# Altium schematic sheet Power.SchDoc: Power
size A3; Organization: Use Organization_Name in ProjParam; Address1: Eliot Ferragni; Address2: STI-MOBOTS; Address3: EPFL; Address4: CH-1015 LAUSANNE; DocumentNumber: 4; Revision: A; SheetNumber: 4; SheetTotal: 11; ApprovedBy: Init ApprovedBy in DocParam; CheckedBy: Init CheckedBy in DocParam; Author: Init Author in DocParam; CompanyName: Init CompanyName in DocParam; DrawnBy: Init DrawBy in DocParam; Engineer: Init Engineer in DocParam; Title2: Power button + 3V + 1.2V + alimentation measures; DocumentName: Init DocumentName in DocParam; ProjectName: Init ProjectName in DocParam
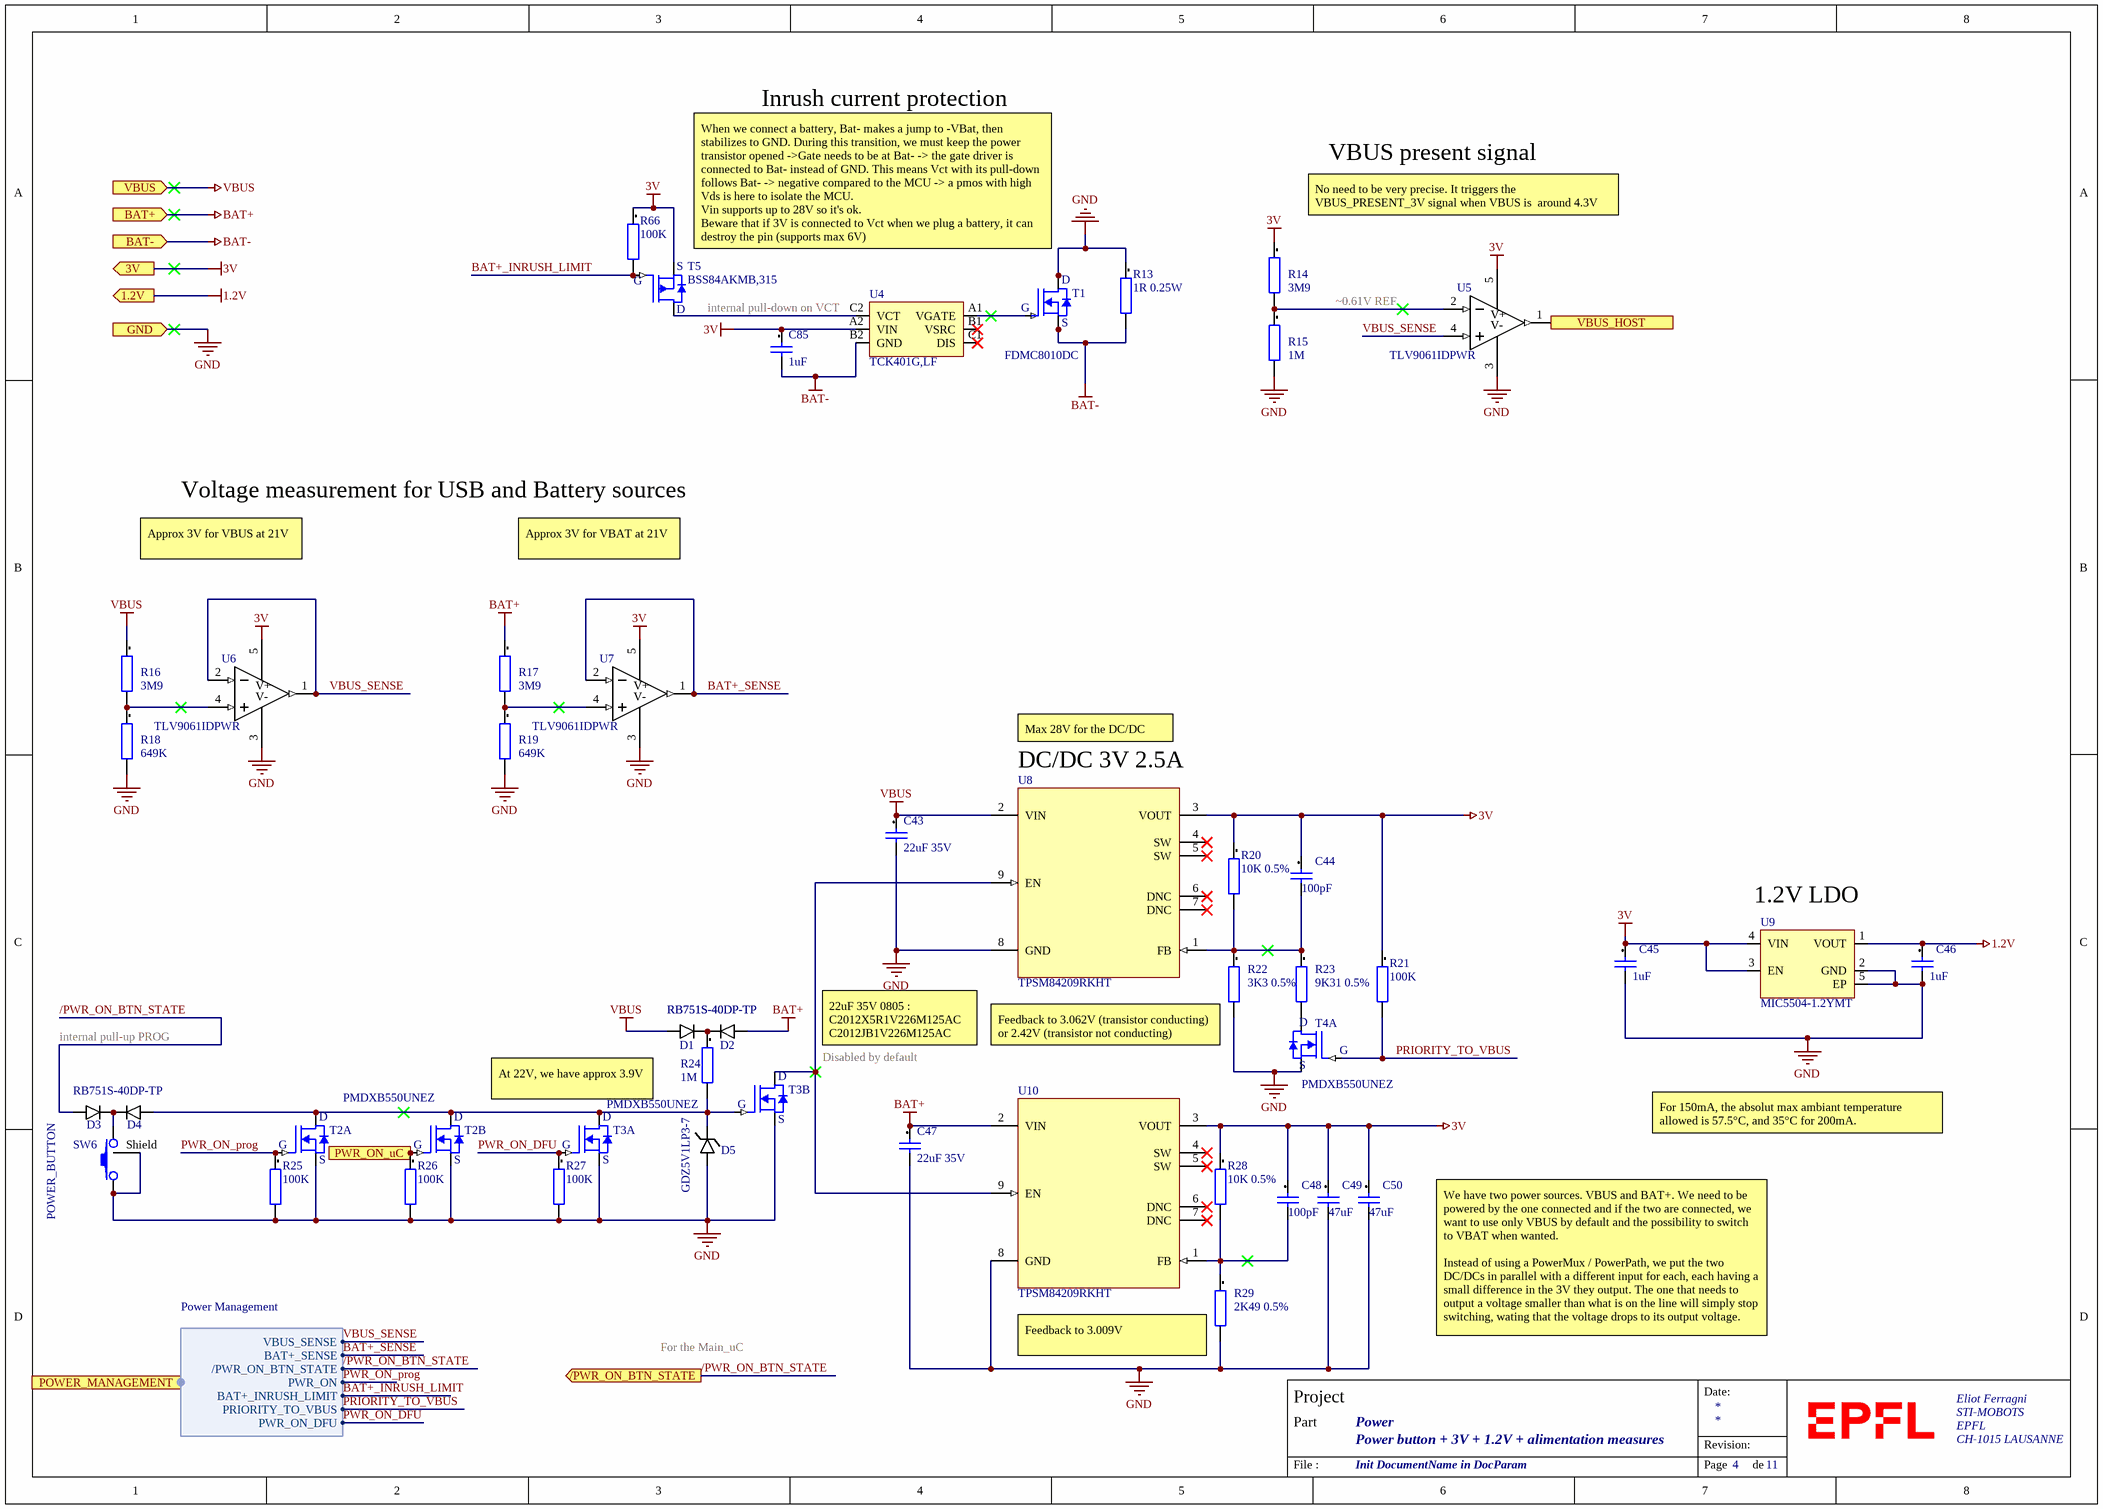
[diagram p0: Power.SchDoc]

## Parts
C43  22uF 35V  [CAPC2012X13L]
C44  100pF  [CAPC0201(0603)33_L]
C45  1uF  [CAPC0201(0603)33_L]
C46  1uF  [CAPC0201(0603)33_L]
C47  22uF 35V  [CAPC2012X13L]
C48  100pF  [CAPC0201(0603)33_L]
C49  47uF  [CAPC1608X08L]
C50  47uF  [CAPC1608X08L]
C85  1uF  [CAPC0201(0603)33_L]
D1  RB751S-40DP-TP  [0201 diode]
D2  RB751S-40DP-TP  [0201 diode]
D3  RB751S-40DP-TP  [0201 diode]  (value not drawn)
D4  RB751S-40DP-TP  [0201 diode]
D5  GDZ5V1LP3-7  [X3-DFN0603-2]
R13  1R 0.25W  [RESC1608X06L]
R14  3M9  [RESC0201(0603)_L]
R15  1M  [RESC0201(0603)_L]
R16  3M9  [RESC0201(0603)_L]
R17  3M9  [RESC0201(0603)_L]
R18  649K  [RESC0201(0603)_L]
R19  649K  [RESC0201(0603)_L]
R20  10K 0.5%  [RESC0201(0603)_L]
R21  100K  [RESC0201(0603)_L]
R22  3K3 0.5%  [RESC1005X04L]
R23  9K31 0.5%  [RESC1005X04L]
R24  1M  [RESC0201(0603)_L]
R25  100K  [RESC0201(0603)_L]
R26  100K  [RESC0201(0603)_L]
R27  100K  [RESC0201(0603)_L]
R28  10K 0.5%  [RESC0201(0603)_L]
R29  2K49 0.5%  [RESC1005X04L]
R66  100K  [RESC0201(0603)_L]
SW6  button  [C&K_KMR2]  (value not drawn)
T1  FDMC8010DC  [PQFN8 3.3X3.3]
T2  PMDXB550UNEZ  [DFN1010B-6]  (parts A,B of 2)
T3  PMDXB550UNEZ  [DFN1010B-6]  (parts A,B of 2)
T4  PMDXB550UNEZ  [DFN1010B-6]  (part A of 2)
T5  BSS84AKMB,315  [DFND1006B-3]
U4  TCK401G,LF  [WCSP6E]
U5  TLV9061IDPWR  [X2SON-5]
U6  TLV9061IDPWR  [X2SON-5]
U7  TLV9061IDPWR  [X2SON-5]
U8  TPSM84209RKHT  [QFN-FCMOD (RKH) 9]
U9  Manufacturer Part Number: MIC5504-1.2YMT  [TDFN-4]  (hidden comment: MIC5504-1.2YMT-TR)
U10  TPSM84209RKHT  [QFN-FCMOD (RKH) 9]

## Ports
1.2V (out), 3V (out), /PWR_ON_BTN_STATE (out), BAT+ (in), BAT- (in), GND (in), POWER_MANAGEMENT (harness Power Management), PWR_ON_uC (in), VBUS (in), VBUS_HOST (out)

## Harnesses
Power Management: VBUS_SENSE, BAT+_SENSE, /PWR_ON_BTN_STATE, PWR_ON, BAT+_INRUSH_LIMIT, PRIORITY_TO_VBUS, PWR_ON_DFU

## Nets
1.2V: C46.1 U9.1(VOUT) ; port 1.2V
3V: C44.1 C45.1 C48.1 C49.1 C50.1 C85.1 R14.1 R20.1 R21.1 R28.1 R66.1 T5.2(S) U4.A2(VIN) U5.5(VCC) U6.5(VCC) U7.5(VCC) U8.3(VOUT) U9.3(EN) U9.4(VIN) U10.3(VOUT) ; port 3V
BAT+: C47.1 D2.1(C) R17.1 U10.2(VIN) ; port BAT+
BAT-: C85.2 R13.2 T1.1(S) T1.2(S) T1.3(S) U4.B2(GND) ; port BAT-
GND: C43.2 C45.2 C46.2 C47.2 C49.2 C50.2 D5.2(C) R13.1 R15.2 R18.2 R19.2 R22.2 R25.2 R26.2 R27.2 R29.2 SW6.1 SW6.Shield T1.5(D) T1.6(D) T1.7(D) T1.8(D) T1.9(D) T2.1(S) T2.4(S) T3.1(S) T3.4(S) T4.1(S) U5.3(VEE) U6.3(VEE) U7.3(VEE) U8.8(GND) U9.2(GND) U9.5(EP) U10.8(GND) ; port GND
VBUS: C43.1 D1.1(C) R16.1 U8.2(VIN) ; port VBUS
/PWR_ON_BTN_STATE: D3.1(C) ; port /PWR_ON_BTN_STATE, port POWER_MANAGEMENT./PWR_ON_BTN_STATE
BAT+_INRUSH_LIMIT: R66.2 T5.1(G) ; port POWER_MANAGEMENT.BAT+_INRUSH_LIMIT
BAT+_SENSE: U7.1(OUT) U7.2(IN-) ; port POWER_MANAGEMENT.BAT+_SENSE
PRIORITY_TO_VBUS: R21.2 T4.2(G) ; port POWER_MANAGEMENT.PRIORITY_TO_VBUS
PWR_ON_DFU: R27.1 T3.2(G) ; port POWER_MANAGEMENT.PWR_ON_DFU
PWR_ON_prog: R25.1 T2.2(G) ; port POWER_MANAGEMENT.PWR_ON
PWR_ON_uC: R26.1 T2.5(G) ; port PWR_ON_uC
VBUS_HOST: U5.1(OUT) ; port VBUS_HOST
VBUS_SENSE: U5.4(IN+) U6.1(OUT) U6.2(IN-) ; port POWER_MANAGEMENT.VBUS_SENSE
NetC44_2: C44.2 R20.2 R22.1 R23.1 U8.1(FB)
NetC48_2: C48.2 R28.2 R29.1 U10.1(FB)
NetD1_2: D1.2(C) D2.2(C) R24.1
NetD3_2: D3.2(C) D4.2(C) SW6.2
NetD4_1: D4.1(C) D5.1(C) R24.2 T2.3(D) T2.6(D) T3.5(G) T3.6(D)
NetR14_2: R14.2 R15.1 U5.2(IN-)
NetR16_2: R16.2 R18.1 U6.4(IN+)
NetR17_2: R17.2 R19.1 U7.4(IN+)
NetR23_2: R23.2 T4.6(D)
NetT1_4: T1.4(G) U4.A1(VGATE)
NetT3_3: T3.3(D) U8.9(EN) U10.9(EN)
NetT5_3: T5.3(D) U4.C2(VCT)

Not connected (* = marked no-connect by the designer): U4 B1(VSRC)* C1(DIS)*; U8 4(SW)* 5(SW)* 6(DNC)* 7(DNC)*; U10 4(SW)* 5(SW)* 6(DNC)* 7(DNC)*

## Notes on the sheet
- Inrush current protection
- VBUS present signal
- When we connect a battery, Bat- makes a jump to -VBat, then stabilizes to GND. During this transition, we must keep the power transistor opened ->Gate needs to be at Bat- -> the gate driver is connected to Bat- instead of GND. This means Vct with its pull-down follows Bat- -> negative compared to the MCU -> a pmos with high Vds is here to isolate the MCU.
  Vin supports up to 28V so it's ok.
  Beware that if 3V is connected to Vct when we plug a battery, it can destroy the pin (supports max 6V)
- No need to be very precise. It triggers the VBUS_PRESENT_3V signal when VBUS is  around 4.3V
- (near U4) internal pull-down on VCT
- ~0.61V REF
- Voltage measurement for USB and Battery sources
- Approx 3V for VBUS at 21V
- Approx 3V for VBAT at 21V
- (near U8) DC/DC 3V 2.5A
- Max 28V for the DC/DC
- (near U9) 1.2V LDO
- internal pull-up PROG
- 22uF 35V 0805 :
  C2012X5R1V226M125AC
  C2012JB1V226M125AC
- (near R22) Feedback to 3.062V (transistor conducting) or 2.42V (transistor not conducting)
- At 22V, we have approx 3.9V
- Disabled by default
- For 150mA, the absolut max ambiant temperature allowed is 57.5°C, and 35°C for 200mA.
- POWER_BUTTON
- For the Main_uC
- (near R29) Feedback to 3.009V
- We have two power sources. VBUS and BAT+. We need to be powered by the one connected and if the two are connected, we want to use only VBUS by default and the possibility to switch to VBAT when wanted.
  Instead of using a PowerMux / PowerPath, we put the two DC/DCs in parallel with a different input for each, each having a small difference in the 3V they output. The one that needs to output a voltage smaller than what is on the line will simply stop switching, wating that the voltage drops to its output voltage.
- Date:
- Project
- Part
- Revision:
- File :
- Page
- de
- (in symbol TLV9061IDPWR) V+; V-

## Library data of the parts
C43 C47 = TBD Capacitor[[/\]]0805[[/\]]1: Capacitor 0805; Manufacturer: TDK; Manufacturer part number: C2012X5R1V226M125AC; Preference: 1; Currentie: CHF; Type: SMD; Note: To buy by assembler; Size: 0805; Footprint Acort: 0805_G; ROHS: True; DateLastUpdate: 2012-11-19 / 14:37:26; Package / Case: Capacitor 0805
C44-C46 C48 C85 = TBD Capacitor[[/\]]0201[[/\]]1: Capacitor 0201; Preference: 1; Currentie: CHF; Type: SMD; Note: To buy by assembler; Size: 0201; Footprint Acort: 0201; ROHS: True; DateLastUpdate: 2018-10-19 / 8:59:52 AM; Manufacturer: -; Manufacturer part number: -; Package / Case: Capacitor 0201
C49 C50 = TBD Capacitor[[/\]]0603[[/\]]1: Capacitor 0603; Preference: 1; Currentie: CHF; Type: SMD; Note: To buy by assembler; Size: 0603; Footprint Acort: 0603_G; ROHS: True; DateLastUpdate: 2012-11-19 / 14:36:40; Manufacturer: -; Manufacturer part number: -; Package / Case: Capacitor 0603
D1-D4 = RB751S-40DP-TP: Schottky Diodes & Rectifiers 203 Package Schottky Diodes; Manufacturer: Micro Commercial Co; Reverse Voltage (DC): 28V; Average Rectified Current: 30mA; Element Configuration: Single; Forward Current: 200mA; Max Repetitive Reverse Voltage (Vrrm): 40V; Peak Reverse Current: 500nA; Max Power Dissipation: 100mW; Type: SMD; Note: To buy by assembler; Supplier 1: Digi-Key; Manufacturer Part Number: RB751S-40DP-TP; Stock 1: 104704; Pricing 1: 1=0.3, 10=0.27, 100=0.1514, 500=0.08112, 1000=0.05516 (USD); Mount: Surface Mount; Case/Package: 0201; Case Code (Metric): 0603; Case Code (Imperial): 0201; Max Operating Temperature: 125°C; Packaging: Tape and Reel; Termination: SMD/SMT; Max Forward Surge Current (Ifsm): 200mA; Package Quantity: 10000; Max Reverse Voltage (DC): 40V; Length: 0.67mm; Height: 0.34mm; Width: 0.37mm; Supplier Part Number 1: RB751S-40DP-TPMSCT-ND; Package / Case: Diode 0201
D5 = GDZ5V1LP3-7: DIODE ZENER 5.1V 250MW 2DFN; Manufacturer: Diodes Incorporated; Tolerance: 5%; Max Reverse Leakage Current: 200nA; Element Configuration: Single; Type: SMD; Note: To buy by assembler; Supplier 1: Digi-Key; Manufacturer Part Number: GDZ5V1LP3-7; Stock 1: 50190; Pricing 1: 1=0.37, 10=0.303, 100=0.1607, 500=0.1057, 1000=0.07188 (USD); Mount: Surface Mount; Case/Package: DFN; Number of Pins: 2; Min Operating Temperature: -55°C; Max Operating Temperature: 150°C; Packaging: Tape and Reel; Max Power Dissipation: 250mW; Package Quantity: 10000; Zener Voltage: 5.1V; Zener Current: 200nA; Voltage Tolerance: 5%; Peak Reverse Current: 200nA; Power Rating: 250mW; Length: 0.62mm; Height: 0.3mm; Width: 0.32mm; Radiation Hardening: No; REACH SVHC: No SVHC; ComponentLink1URL: https://www.diodes.com/assets/Datasheets/GDZxVxLP3.pdf; ComponentLink1Description: https://www.diodes.com/assets/Datasheets/GDZxVxLP3.pdf; Supplier Part Number 1: GDZ5V1LP3-7DICT-ND; Package / Case: X3-DFN0603-2
R13 = TBD[[/\]]0603[[/\]]1: Resistor 0603; Preference: 1; Currentie: CHF; Note: To buy by assembler; Size: 0603; Footprint Acort: 0603; ROHS: True; DateLastUpdate: 2012-11-19 / 14:13:33; Type: SMD; Manufacturer: -; Manufacturer part number: -; Package / Case: Resistor 0603
R14-R21 R24-R28 R66 = TBD[[/\]]0201[[/\]]1: Resistor 0201; Preference: 1; Currentie: CHF; Note: To buy by assembler; Size: 0201; Footprint Acort: 0201; ROHS: True; DateLastUpdate: 2018-10-19 / 9:06:49 AM; Type: SMD; Manufacturer: -; Manufacturer part number: -; Package / Case: Resistor 0201
R22 R23 R29 = TBD[[/\]]0402[[/\]]1: Resistor 0402; Preference: 1; Currentie: CHF; Note: To buy by assembler; Size: 0402; Footprint Acort: 0402; ROHS: True; DateLastUpdate: 2012-11-19 / 14:13:38; Type: SMD; Manufacturer: -; Manufacturer part number: -; Package / Case: Resistor 0402
SW6 = C&K KMR2: KMR221GLFS; Manufacturer: C&K; Manufacturer Nr: 7-188275-6; Preference: 1; Currentie: CHF; Quant_1: 10; Quant_2: 900; Circuit: SPST-NO; Switch Function: Off-Mom; Contact Rating @ Voltage: 0.05A @ 32VDC; Actuator Type: Standard; Actuator Height off PCB, from Pins: 1.90mm; Actuator Orientation: Top Actuated; Outline: 4.60mm x 2.80mm; Illumination: Non-Illuminated; Operating Force: 200gf; Switch Travel: 0.25mm; Mechanical Life: 200,000 Cycles; Note: To buy by assembler; Footprint Acort: ToDefine; ComponentLink1Description: Datasheet; ComponentLink1URL: http://ecommas.tycoelectronics.com/commerce/DocumentDelivery/DDEController?Action=showdoc&DocId=Customer+Drawing%7F188275%7FR%7Fpdf%7FEnglish%7FC_188275_R.pdf; Supplier: Farnell; Supplier Nr: 1056234; ComponentLink2Description: Farnell link; ComponentLink2URL: http://fr.farnell.com/jsp/displayProduct.jsp?sku=1056234; ROHS: True; Type: SMD; Orientation: Vertical; DateLastUpdate: 2007-12-04 / 09:15:57; Price_1: 1,1; Price_2: 0,924; Supplier 1: Digi-Key; Manufacturer Part Number: KMR221GLFS; Category: Switches; Stock 1: 20549; Pricing 1: 1=0.51, 10=0.493, 25=0.484, 50=0.4656, 100=0.4017, 250=0.3652, 500=0.34694, 1000=0.2739 (USD); Packaging: Cut Tape (CT); Mounting Type: Surface Mount; Termination Style: Gull Wing; Illumination Voltage (Nominal): -; Illumination Type, Color: -; Ingress Protection: -; Features: Grounding Pin; Actuator Material: -; Operating Temperature: -40°C ~ 85°C; ComponentLink3URL: http://www.ck-components.com/index.php?module=media&action=Display&cmpref=14414&lang=en&width=&height=&format=&alt=; ComponentLink3Description: http://www.ck-components.com/index.php?module=media&action=Display&cmpref=14414&lang=en&width=&height=&format=&alt=; Supplier Part Number 1: 401-1427-1-ND; Package / Case: SMD Button
T1 = FDMC8010DC: Power transistor; Manufacturer: ON Semiconductor / Fairchild; Element Configuration: Dual; Type: SMD; Note: To buy by assembler; Supplier 1: Digi-Key; Manufacturer Part Number: FDMC8010DC; Stock 1: 36; Pricing 1: 1 = 1,29000, 10 = 1,15600, 100 = 0,90120, 500 = 0,74448, 1000 = 0,58774 (USD); RoHS: No; Mount: Surface Mount; Weight: 0.039g; Min Operating Temperature: -55°C; Max Operating Temperature: 150°C; Supplier Part Number 1: FDMC8010DCOSCT-ND; Package / Case: Dual Cool 33
T2-T4 = PMDXB550UNEZ: DUAL N-CHANNEL 30V; Manufacturer: NXP Semiconductors; Continuous Drain Current (ID): 590mA; Max Power Dissipation: 285mW; Rds On Max: 670mR; Input Capacitance: 30.3pF; FET Type: 2 N-Channel; Type: SMD; Note: To buy by assembler; Supplier 1: Digi-Key; Stock 1: 5582; Pricing 1: 1=0.48, 10=0.379, 100=0.2601, 500=0.17838, 1000=0.13379 (USD); Mount: Surface Mount; Min Operating Temperature: -55°C; Max Operating Temperature: 150°C; Drain to Source Voltage (Vdss): 30V; Packaging: Tape and Reel; Supplier Part Number 1: 1727-2277-1-ND; Manufacturer Part Number: PMDXB550UNEZ; Package / Case: DFN1010B-6
T5 = BSS84AKMB,315: MOSFET P-CH 50V 230MA 3DFN; Manufacturer: Nexperia; Supplier 1: Digi-Key; Manufacturer Part Number: BSS84AKMB,315; Stock 1: 17379; Pricing 1: 1 = 0,29000, 10 = 0,23700, 25 = 0,19800, 100 = 0,09680, 500 = 0,08074, 1000 = 0,05610, 2500 = 0,05214, 5000 = 0,04510 (USD); RoHS: No; ComponentLink1URL: https://assets.nexperia.com/documents/data-sheet/BSS84AKMB.pdf?src-supplier=Digi-Key; ComponentLink1Description: https://assets.nexperia.com/documents/data-sheet/BSS84AKMB.pdf?src-supplier=Digi-Key; Supplier Part Number 1: 1727-1264-1-ND
U4 = TCK401G,LF: Manufacturer: Toshiba; Note: To buy by assembler; Supplier 1: Digi-Key; Stock 1: 12722; Pricing 1: 1 = 0,62000, 10 = 0,54400, 25 = 0,51080, 100 = 0,41690, 250 = 0,38728, 500 = 0,32960, 1000 = 0,26368, 2500 = 0,23896 (USD); RoHS: No; Supplier Part Number 1: TCK401GLFCT-ND; Manufacturer Part Number: TCK401G,LF; Type: SMD; Package / Case: WSCSP6E
U5-U7 = TLV9061IDPWR: OPAMP; Manufacturer: Texas Instruments; Number of Channels: 1; Note: To buy by assembler; Supplier 1: Digi-Key; Stock 1: 1920; Pricing 1: 1 = 0,59000, 10 = 0,51700, 100 = 0,39610, 500 = 0,31312, 1000 = 0,25050 (USD); RoHS: No; Min Operating Temperature: -40°C; Max Operating Temperature: 125°C; ComponentLink1URL: http://www.ti.com/lit/ds/symlink/tlv9061.pdf?src-supplier=Farnell; ComponentLink1Description: http://www.ti.com/lit/ds/symlink/tlv9061.pdf?src-supplier=Farnell; ComponentLink2URL: http://www.ti.com/lit/ds/symlink/tlv9061.pdf?src-supplier=Digi-Key; ComponentLink2Description: http://www.ti.com/lit/ds/symlink/tlv9061.pdf?src-supplier=Digi-Key; Supplier Part Number 1: 296-49053-1-ND; Manufacturer Part Number: TLV9061IDPWR; Type: SMD; Package / Case: X2SON-5
U8 U10 = TPSM84209RKHT: DC DC CONVERTER 1.2-6V 15W; Manufacturer: Texas Instruments; Voltage - Input (Min): 4.5V; Voltage - Input (Max): 28V; Voltage - Output 1: 1.2 ~ 6 V; Current - Output (Max): 2.5A; Efficiency: 86.5%; Note: To buy by assembler; Supplier 1: Digi-Key; Manufacturer Part Number: TPSM84209RKHT; RoHS: Request Inventory Verification; Category: Power Supplies - Board Mount; Stock 1: 47; Pricing 1: 1=5.04, 10=4.53, 100=3.7117 (USD); Packaging: Cut Tape (CT); Part Status: Active; Type: SMD; Voltage - Output 2: -; Voltage - Output 3: -; Voltage - Output 4: -; Applications: ITE (Commercial); Features: OCP, OTP, UVLO; Operating Temperature: -40°C ~ 85°C (With Derating); Mounting Type: Surface Mount; Package / Case: QFN-FCMOD; Size / Dimension: 0.18" L x 0.16" W x 0.08" H (4.5mm x 4.0mm x 2.1mm); Supplier Device Package: 9-QFN-FCMOD (4.5x4); ComponentLink1URL: http://www.ti.com/lit/ds/symlink/tpsm84209.pdf; ComponentLink1Description: http://www.ti.com/lit/ds/symlink/tpsm84209.pdf
U9 = MIC5504-1.2YMT-TR: IC REG LINEAR 1.2V 300MA 4TDFN; Manufacturer: Microchip; Dropout Voltage: 160mV; Number of Regulators: 1; Min Current Limit: 400mA; Note: To buy by assembler; Supplier 1: Digi-Key; Stock 1: 2603; Pricing 1: 1 = 0,16000, 25 = 0,13400, 100 = 0,12360 (USD); RoHS: Yes; Mount: Surface Mount; Min Operating Temperature: -40°C; Max Operating Temperature: 125°C; Packaging: Tape and Reel; Output Voltage: 1.2V; Output Current: 300mA; ComponentLink1URL: http://www.microchip.com/mymicrochip/filehandler.aspx?ddocname=en580292&src-supplier=Digi-Key; ComponentLink1Description: http://www.microchip.com/mymicrochip/filehandler.aspx?ddocname=en580292&src-supplier=Digi-Key; Supplier Part Number 1: MIC5504-1.2YMT-CT-ND; Type: SMD; Package / Case: TDFN-4